# EAGLE design vn210-shield (EAGLE 6.2)
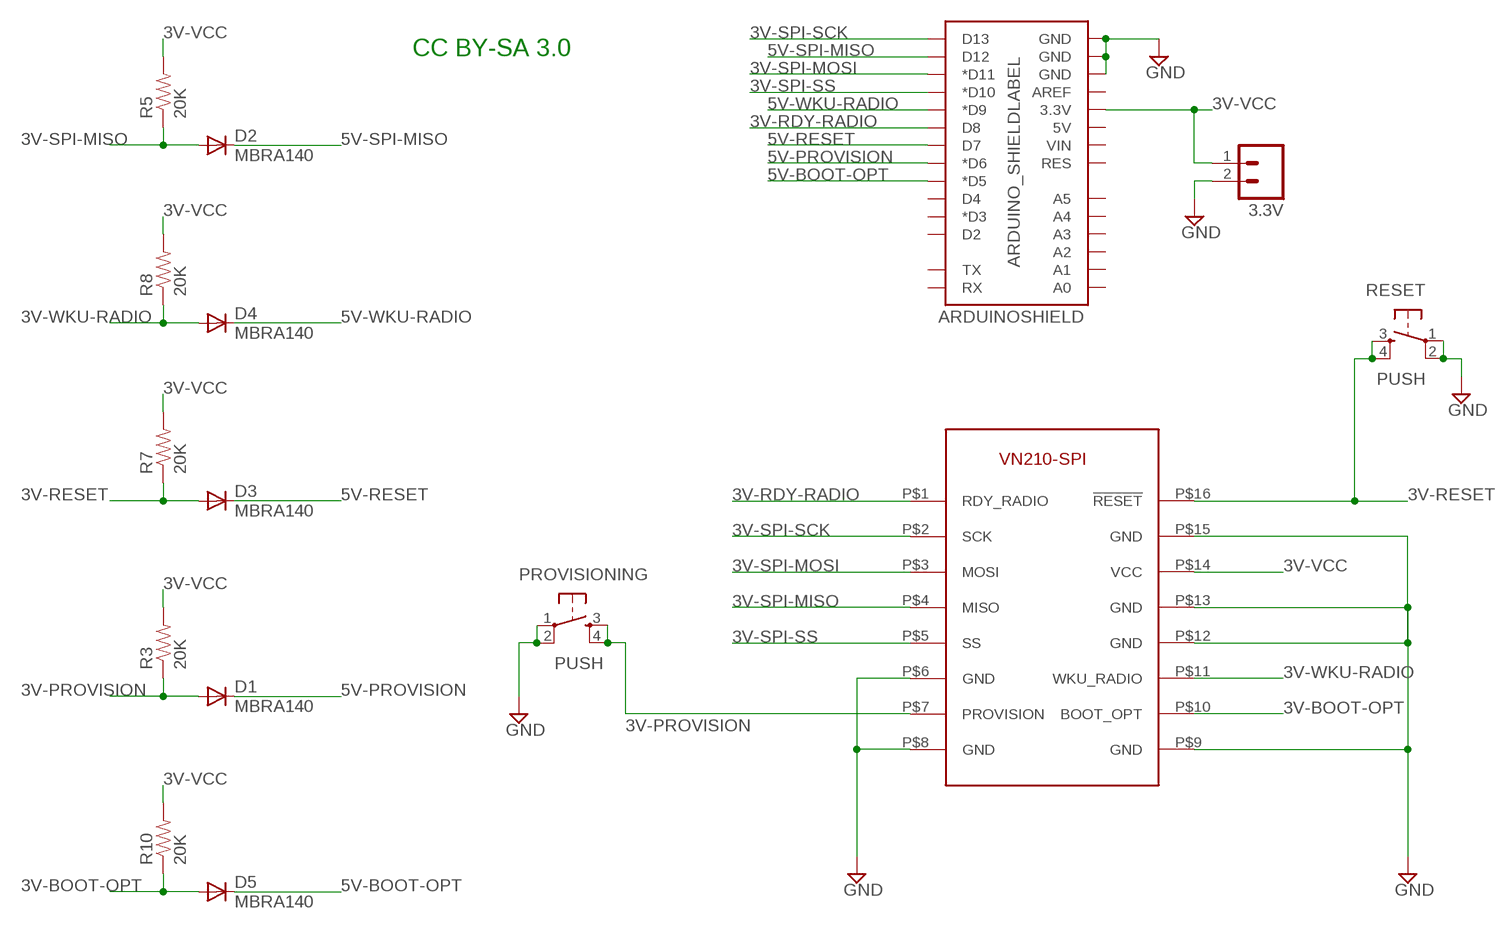
[diagram p0: schematic, sheet 1]

## Parts
3.3V  M02LOCK  [1X02_LOCK]
ARDUINOSHIELD  ARDUINO_SHIELDLABEL  [DUEMILANOVE_SHIELD]
D1  MBRA140  DIODESMA-ALT  [SMA-DIODE_ALT]
D2  MBRA140  DIODESMA-ALT  [SMA-DIODE_ALT]
D3  MBRA140  DIODESMA-ALT  [SMA-DIODE_ALT]
D4  MBRA140  DIODESMA-ALT  [SMA-DIODE_ALT]
D5  MBRA140  DIODESMA-ALT  [SMA-DIODE_ALT]
PROVISIONING  PUSH  TAC_SWITCHPTH  [TACTILE-PTH]
R3  20K  RESISTOR1206  [1206]
R5  20K  RESISTOR1206  [1206]
R7  20K  RESISTOR1206  [1206]
R8  20K  RESISTOR1206  [1206]
R10  20K  RESISTOR1206  [1206]
RESET  PUSH  TAC_SWITCHPTH  [TACTILE-PTH]
U$1  VN210-BREAKOUT  [VN210-BREAKOUT]

## Nets
3V-BOOT-OPT: D5.A R10.1 U$1.P$10(BOOT_OPT)
3V-PROVISION: D1.A PROVISIONING.3 PROVISIONING.4 R3.1 U$1.P$7(PROVISION)
3V-RDY-RADIO: ARDUINOSHIELD.D8 U$1.P$1(RDY_RADIO)
3V-RESET: D3.A R7.1 RESET.3 RESET.4 U$1.P$16(!RESET)
3V-SPI-MISO: D2.A R5.1 U$1.P$4(MISO)
3V-SPI-MOSI: ARDUINOSHIELD.D11(*D11) U$1.P$3(MOSI)
3V-SPI-SCK: ARDUINOSHIELD.D13 U$1.P$2(SCK)
3V-SPI-SS: ARDUINOSHIELD.D10(*D10) U$1.P$5(SS)
3V-VCC: 3.3V.1 ARDUINOSHIELD.3.3V R3.2 R5.2 R7.2 R8.2 R10.2 U$1.P$14(VCC)
3V-WKU-RADIO: D4.A R8.1 U$1.P$11(WKU_RADIO)
5V-BOOT-OPT: ARDUINOSHIELD.D5(*D5) D5.C
5V-PROVISION: ARDUINOSHIELD.D6(*D6) D1.C
5V-RESET: ARDUINOSHIELD.D7 D3.C
5V-SPI-MISO: ARDUINOSHIELD.D12 D2.C
5V-WKU-RADIO: ARDUINOSHIELD.D9(*D9) D4.C
GND: 3.3V.2 ARDUINOSHIELD.GND@0(GND) ARDUINOSHIELD.GND@1(GND) ARDUINOSHIELD.GND@2(GND) PROVISIONING.1 PROVISIONING.2 RESET.1 RESET.2 U$1.P$6(GND) U$1.P$8(GND) U$1.P$9(GND) U$1.P$12(GND) U$1.P$13(GND) U$1.P$15(GND)
Unconnected: ARDUINOSHIELD.5V ARDUINOSHIELD.A0 ARDUINOSHIELD.A1 ARDUINOSHIELD.A2 ARDUINOSHIELD.A3 ARDUINOSHIELD.A4 ARDUINOSHIELD.A5 ARDUINOSHIELD.AREF ARDUINOSHIELD.D2 ARDUINOSHIELD.D3(*D3) ARDUINOSHIELD.D4 ARDUINOSHIELD.RES ARDUINOSHIELD.RX ARDUINOSHIELD.TX ARDUINOSHIELD.VIN

## Notes on the sheet
- CC BY-SA 3.0

## Library data of the parts
3.3V = SparkFun:M02: Header 2 Standard 2-pin 0.1" header. Use with straight break away headers (SKU : PRT-00116), right angle break away headers (PRT-00553), swiss pins (PRT-00743), machine pins (PRT-00117), and female headers (PRT-00115). Molex polarized connector foot print use with SKU : PRT-08233 with associated crimp pins and housings.
ARDUINOSHIELD = SparkFun:ARDUINO_SHIELD
D1-D5 = SparkFun:DIODE: Diode These are standard reverse protection diodes and small signal diodes. SMA package can handle up to about 1A. SOD-323 can handle about 200mA. What the SOD-323 package when ordering, there are some mfgs out there that are 5-pin packages.
PROVISIONING RESET = SparkFun:TAC_SWITCH: Momentary Switch Button commonly used for reset or general input. Spark Fun Electronics SKU : COM-00097
R3 R5 R7 R8 R10 = SparkFun:RESISTOR: Resistor Basic schematic elements and footprints for 0603, 1206, and PTH resistors.
U$1 = nivis-vn210:VN210-BREAKOUT

## Board
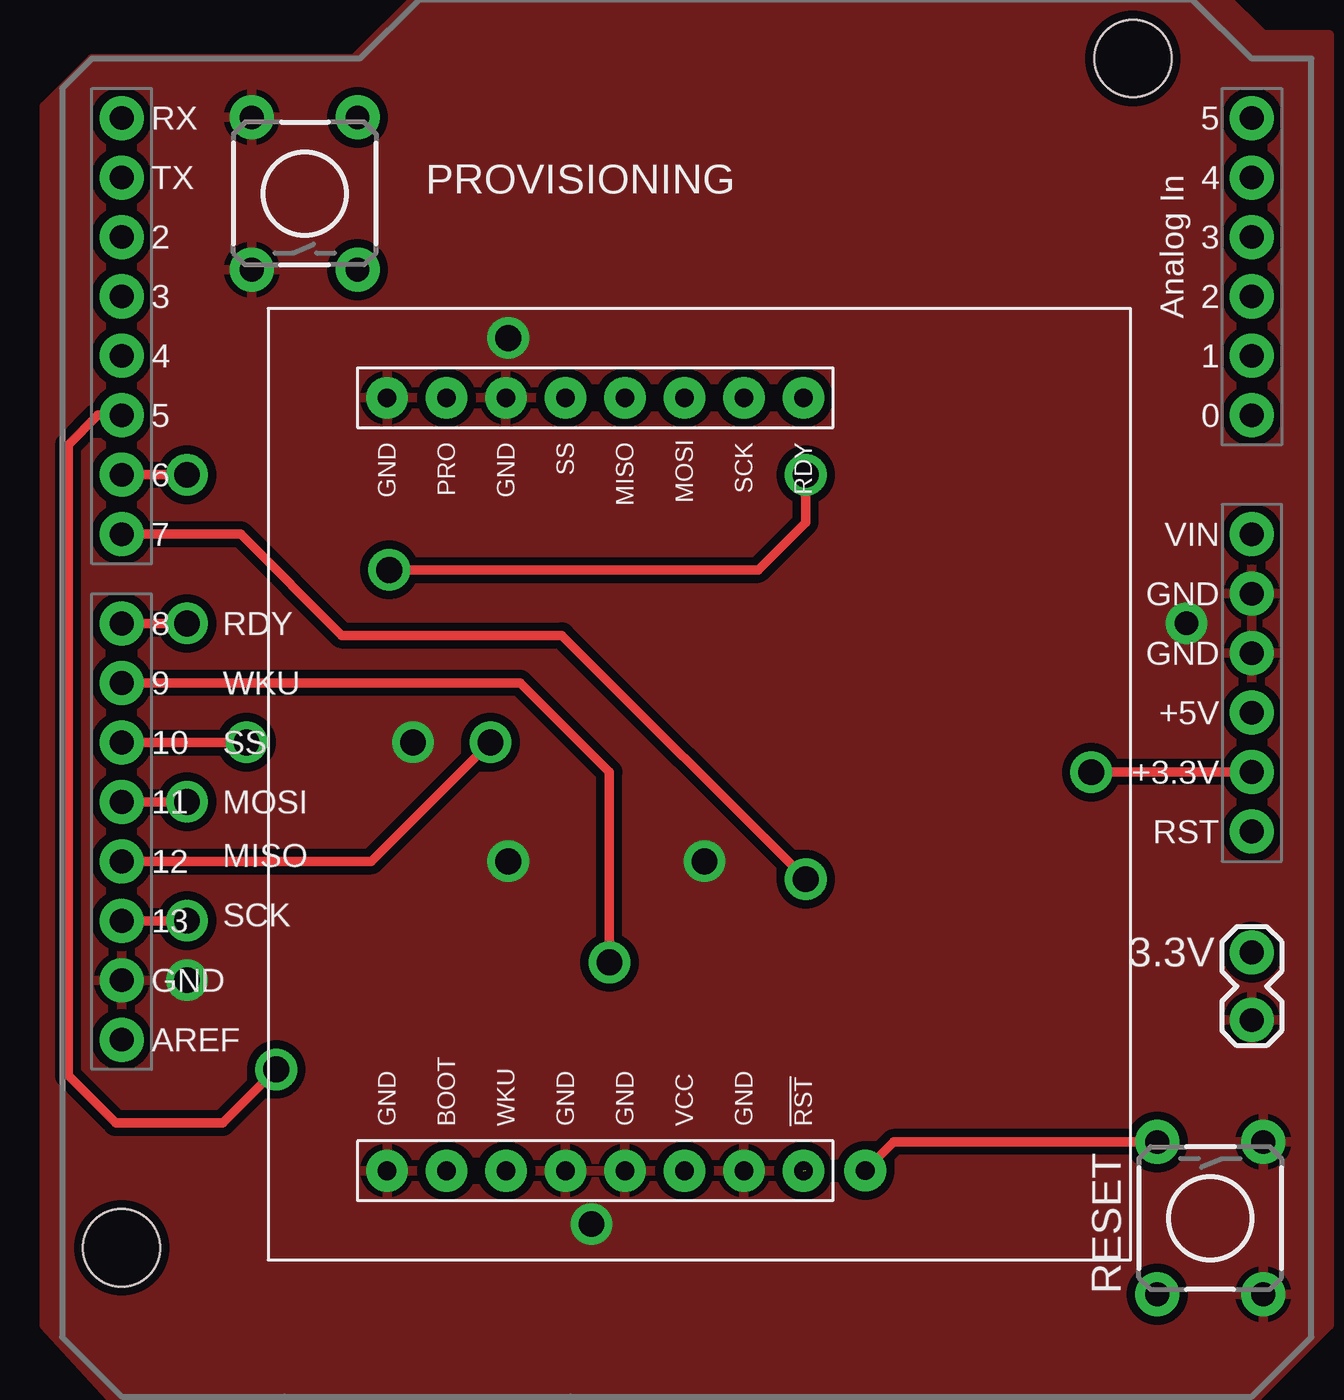
[diagram p1: board, top side]
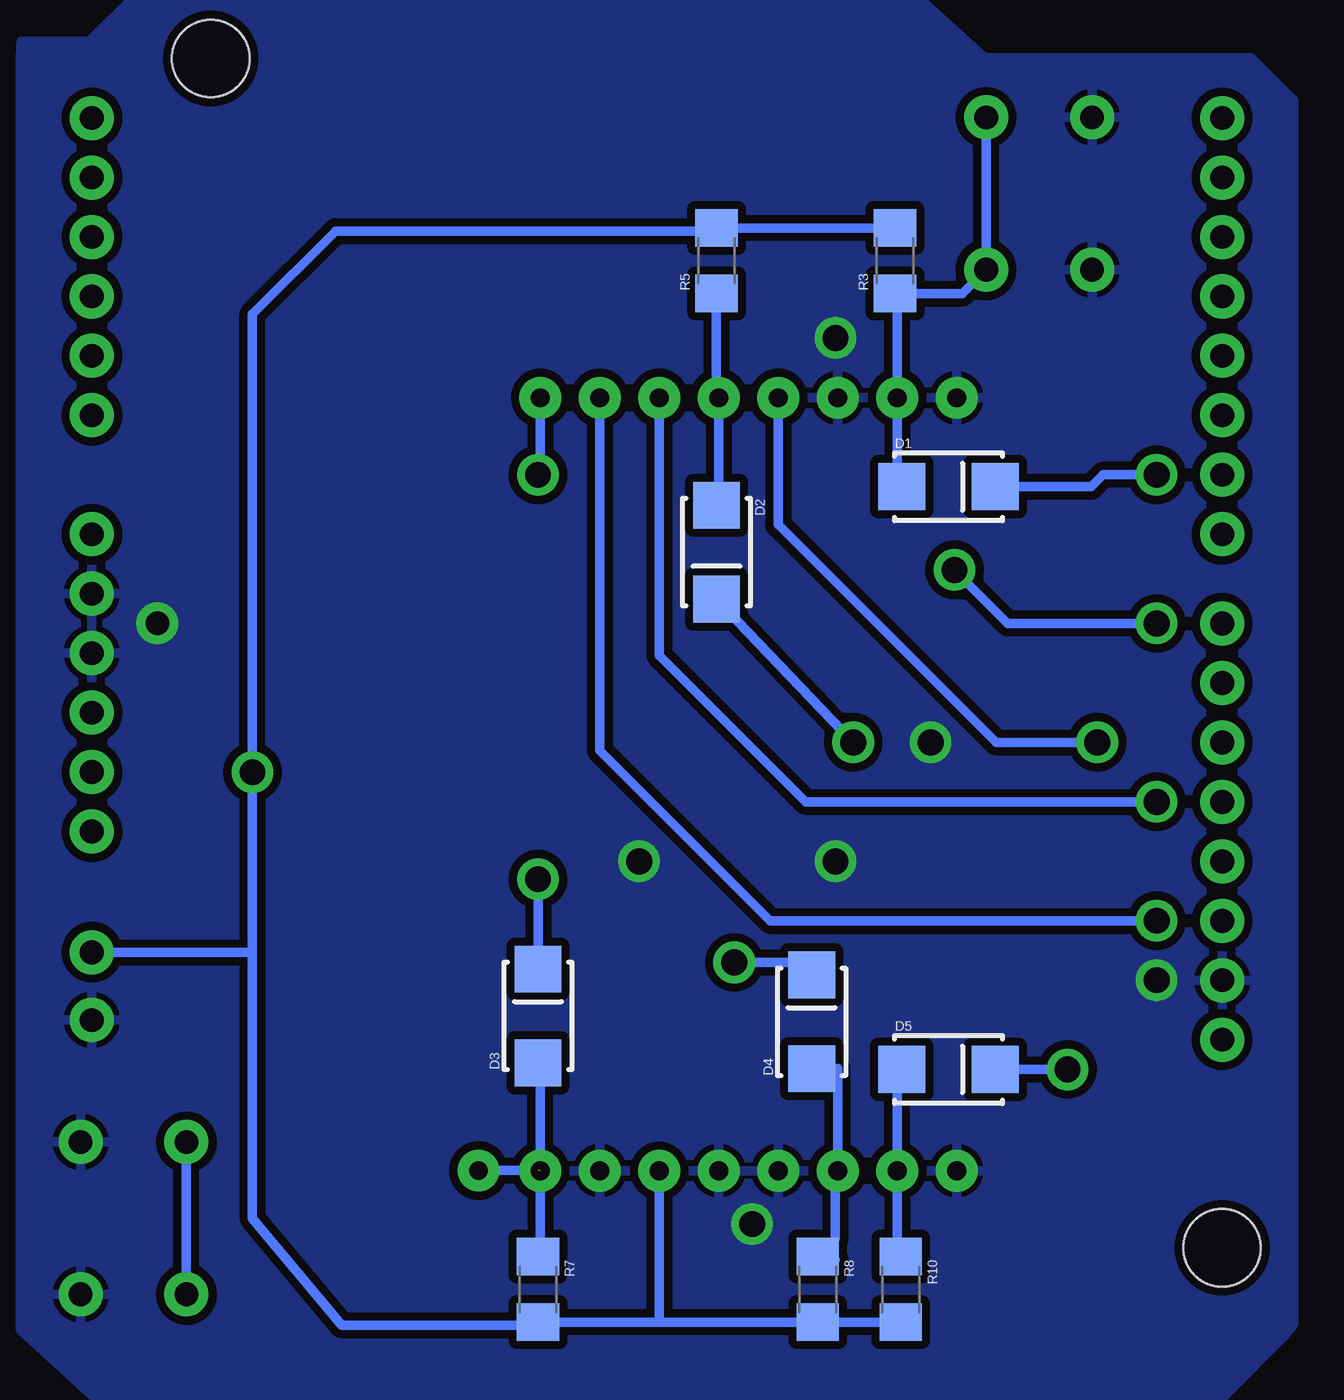
[diagram p2: board, bottom side, seen from below]

No outline drawn. Coordinates in mm, seen from the top.
Copper layers (1*16): Top 0.0356mm / dielectric 1.5011mm / Bottom 0.0356mm
Design rules: minimum track width 10mil, minimum drill 13mil, track to track 14mil, track to pad 12mil, pad to pad 12mil, via to via 12mil, smd to smd 12mil, copper to edge 15mil, drill to drill 6mil, minimum pad ring 7mil, minimum via ring 7mil, stop-mask expansion 4mil, vias tented up to drill 0mil, thermal gap 10mil

### Footprints (pad centres in the part's own frame; a part is rotated, then mirrored left to right if it is on the bottom)
1X02_LOCK = drill 1.016 pad 1.88: 1 -0.178,0; 2 2.718,0
DUEMILANOVE_SHIELD = drill 1.016 pad 1.88: 3.3V 50.8,26.67; 5V 50.8,29.21; A0 50.8,41.91; A1 50.8,44.45; A2 50.8,46.99; A3 50.8,49.53; A4 50.8,52.07; A5 50.8,54.61; AREF 2.54,15.24; D2 2.54,49.53; D3 2.54,46.99; D4 2.54,44.45; D5 2.54,41.91; D6 2.54,39.37; D7 2.54,36.83; D8 2.54,33.02; D9 2.54,30.48; D10 2.54,27.94; D11 2.54,25.4; D12 2.54,22.86; D13 2.54,20.32; GND@0 50.8,31.75; GND@1 50.8,34.29; GND@2 2.54,17.78; RES 50.8,24.13; RX 2.54,54.61; TX 2.54,52.07; VIN 50.8,36.83 | hole 3.302: 45.72,57.15; 2.54,6.35
SMA-DIODE_ALT = smd 2 x 2: A -2,0; C 2,0
TACTILE-PTH = drill 1.016 pad 1.88: 1 -3.251,2.261; 2 3.251,2.261; 3 -3.251,-2.261; 4 3.251,-2.261
1206 = smd 1.6 x 1.8: 1 -1.4,0; 2 1.4,0
VN210-BREAKOUT = drill 0.8 pad 1.778: P$1 3.81,22.86; P$2 3.81,20.32; P$3 3.81,17.78; P$4 3.81,15.24; P$5 3.81,12.7; P$6 3.81,10.16; P$7 3.81,7.62; P$8 3.81,5.08; P$9 36.83,5.08; P$10 36.83,7.62; P$11 36.83,10.16; P$12 36.83,12.7; P$13 36.83,15.24; P$14 36.83,17.78; P$15 36.83,20.32; P$16 36.83,22.86

### Placement (x,y rotation side)
3.3V  77.47,35.31 270 top
ARDUINOSHIELD  26.67,16.51 0 top
D1  40.89,55.37 0 bottom
D2  50.8,52.58 270 bottom
D3  58.42,32.77 90 bottom
D4  46.74,32.51 90 bottom
D5  40.89,30.48 0 bottom
PROVISIONING  37.03,67.89 90 top
R3  43.18,65.02 90 bottom
R5  50.8,65.02 90 bottom
R7  58.42,21.08 270 bottom
R8  46.48,21.08 270 bottom
R10  42.93,21.08 270 bottom
RESET  75.69,24.13 270 top
U$1  35.46,62.98 270 top

### Tracks (layer width: path | path; a pad name or v marks a point on that pad's centre or on a via)
3V-BOOT-OPT
  Bottom 0.406: R10.1 43.08,22.64 U$1.P$10 43.08,30.46 D5.A
3V-PROVISION
  Bottom 0.406: PROVISIONING.4 PROVISIONING.3 40.3,63.62 R3.1 43.08,63.53 U$1.P$7 43.08,55.41 D1.A
3V-RDY-RADIO  (via drill 1.1 pad 1.78)
  Top 0.406: ARDUINOSHIELD.D8 v32,49.53 | v40.64,51.82 56.39,51.82 58.42,53.85 v58.42,55.88
  Bottom 0.406: U$1.P$1 58.32,55.98 v58.42,55.88 | v32,49.53 38.35,49.53 v40.64,51.82
3V-RESET  (via drill 0.8 pad 1.78)  (1 unrouted)
  Top 0.406: RESET.3 62.18,27.38 v60.96,26.16
  Bottom 0.406: R7.1 58.32,22.58 U$1.P$16 58.32,31.28 D3.A | RESET.4 RESET.3 | v60.96,26.16 58.42,26.16
3V-SPI-MISO
  Bottom 0.406: R5.1 50.8,59.27 U$1.P$4 50.7,54.83 D2.A
3V-SPI-MOSI  (via drill 1.1 pad 1.78)
  Top 0.406: ARDUINOSHIELD.D11 v32,41.91
  Bottom 0.406: U$1.P$3 53.24,48.16 46.99,41.91 v32,41.91
3V-SPI-SCK  (via drill 1.1 pad 1.78)
  Top 0.406: ARDUINOSHIELD.D13 v32,36.83
  Bottom 0.406: U$1.P$2 55.78,44.1 48.51,36.83 v32,36.83
3V-SPI-SS  (via drill 1.1 pad 1.78)
  Top 0.406: ARDUINOSHIELD.D10 v34.54,44.45
  Bottom 0.406: U$1.P$5 48.16,53.75 38.86,44.45 v34.54,44.45
3V-VCC  (via drill 1.1 pad 1.78)
  Top 0.406: ARDUINOSHIELD.3.3V v70.61,43.18
  Bottom 0.406: R3.2 R5.2 50.93,66.29 67.06,66.29 70.61,62.74 v70.61,43.18 70.61,35.48 | R10.2 R8.2 53.34,19.68 | 53.34,19.68 R7.2 58.54,19.56 66.8,19.56 70.61,24.13 70.61,35.48 | U$1.P$14 53.24,19.78 53.34,19.68 | 3.3V.1 70.61,35.48
3V-WKU-RADIO
  Bottom 0.406: 45.72,22.35 R8.1 45.72,23.24 45.72,26.05 U$1.P$11 45.62,30.52 D4.A
5V-BOOT-OPT  (via drill 1.1 pad 1.78)
  Top 0.406: ARDUINOSHIELD.D5 28.19,58.42 26.92,57.15 26.92,30.23 28.96,28.19 33.53,28.19 v35.81,30.48
  Bottom 0.406: 35.95,30.34 v35.81,30.48 D5.C
5V-PROVISION  (via drill 1.1 pad 1.78)
  Top 0.406: ARDUINOSHIELD.D6 v32,55.88
  Bottom 0.406: D1.C 34.8,55.37 34.29,55.88 v32,55.88
5V-RESET  (via drill 1.1 pad 1.78)
  Top 0.406: ARDUINOSHIELD.D7 34.29,53.34 38.61,49.02 48.01,49.02 v58.42,38.61
  Bottom 0.406: v58.42,38.61 D3.C
5V-SPI-MISO  (via drill 1.1 pad 1.78)
  Top 0.406: ARDUINOSHIELD.D12 39.88,39.37 v44.96,44.45
  Bottom 0.406: v44.96,44.45 D2.C
5V-WKU-RADIO  (via drill 1.1 pad 1.78)
  Top 0.406: v50.04,35.05 50.04,43.18 46.23,46.99 ARDUINOSHIELD.D9
  Bottom 0.406: 46.99,35.05 46.85,34.92 D4.C 46.87,35.05 v50.04,35.05
GND  (via drill 1 pad 1.78, 1.1 pad 1.78)
  other vias: 74.68,49.53 41.66,44.45 45.72,39.37 45.72,61.72 32,34.29 49.28,23.88 54.1,39.37
  pour Bottom: 26.16,19.6 26.16,71.88 27.96,73.69 39.35,73.69 42.12,76.23 75.79,76.22 77.6,74.41 80.48,74.41 80.52,73.69 80.52,19.35 77.48,16.57 29.06,16.57 26.57,19.05
  pour Bottom: 26.16,19.6 26.16,71.88 27.96,73.69 39.35,73.69 42.12,76.23 75.79,76.22 77.6,74.41 80.48,74.41 80.52,73.69 80.52,19.35 77.48,16.57 29.06,16.57 26.57,19.05
  pour Top: 77.72,16.51 28.7,16.51 25.91,19.56 25.91,71.63 27.94,73.66 39.12,73.66 41.91,76.45 76.2,76.45 77.98,74.68 80.77,74.68 80.77,19.56

### Text on the board
tNames: RDY | WKU | SS | MOSI | MISO | SCK
Document: CC BY-SA 3.0